# EAGLE design ESP32 (EAGLE 9.5.2)

## Sheet 1 of 6
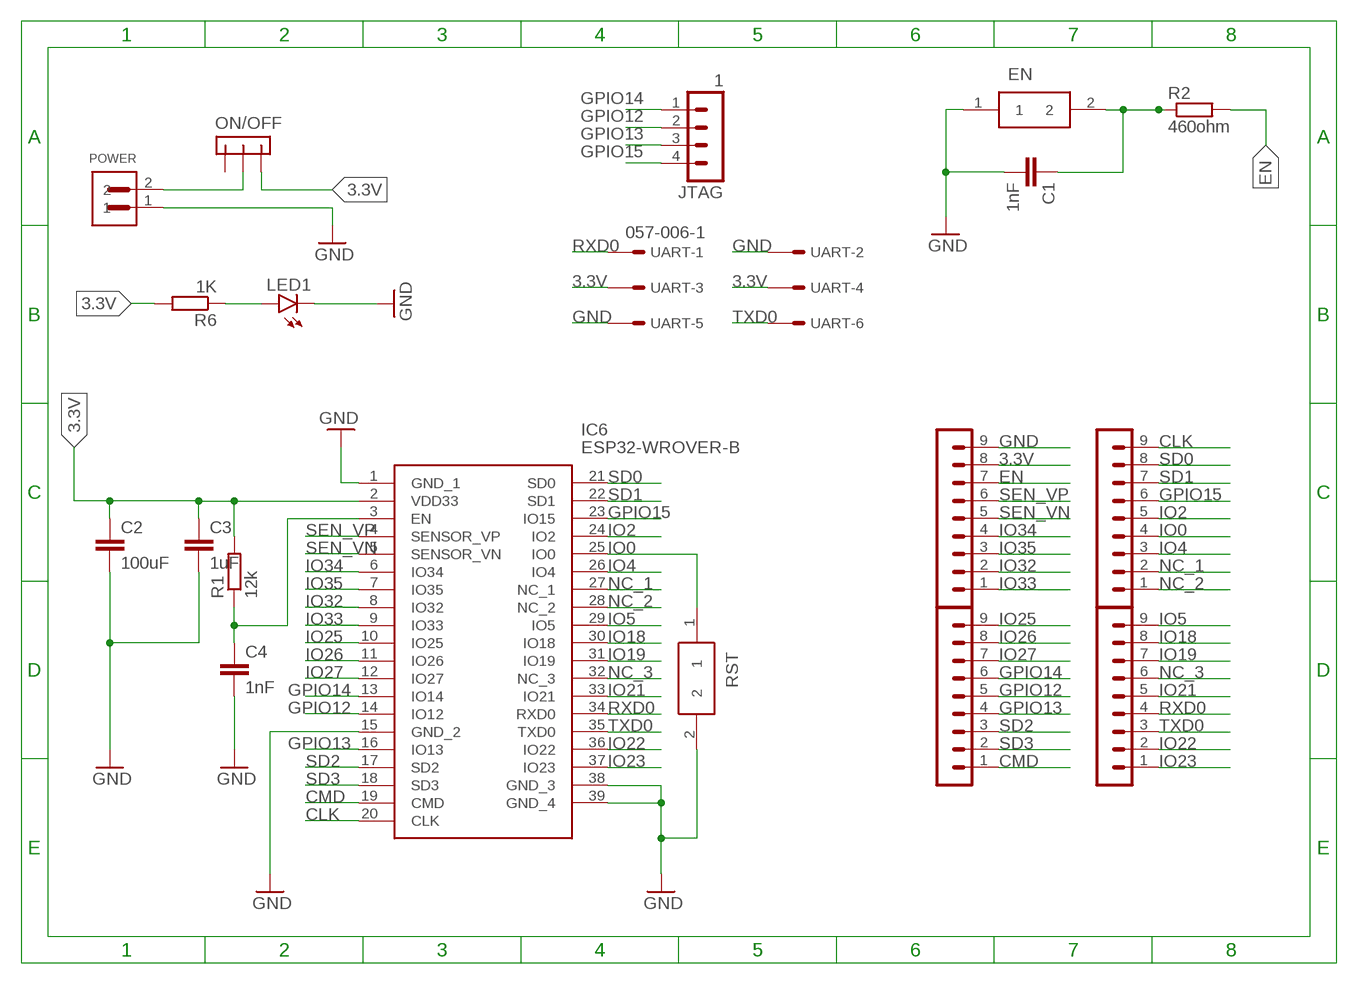
[diagram p0: schematic, sheet 1]

### Parts
C1  1nF  C-EU_805C0805  [C0805]
C2  100uF  C-EU_1206C1206  [C1206]
C3  1uF  C-EU_805C0805  [C0805]
C4  1nF  C-EU_805C0805  [C0805]
EN  FSMSMTR  [FSMSM]
IC6  ESP32-WROVER-B  [ESP32WROVERIB16MB]
JTAG  1  MA04-1  [MA04-1]
LED1  LEDSMT1206  [1206]
ON/OFF  -CON3  [CON3]
POWER  S2B-PH-SM4-TB  [JST_S2B-PH-SM4-TB]
R1  12k  R-EU_805R0805  [R0805]
R2  460ohm  R-EU_805R0805  [R0805]
R6  1K  R-EU_R1206  [R1206]
RST  FSMSMTR  [FSMSM]
SV1  PINHEADER-1X9  [MA09-1]
SV2  PINHEADER-1X9  [MA09-1]
SV5  PINHEADER-1X9  [MA09-1]
SV6  PINHEADER-1X9  [MA09-1]
UART  057-006-1  [057-006-1]

### Nets
3.3V: C2.1 C3.1 IC6.2(VDD33) ON/OFF.P$1 R1.2 R6.2 SV5.8 UART.3 UART.4
CLK: IC6.20(CLK) SV1.9
CMD: IC6.19(CMD) SV6.1
EN [other]: C1.1 C4.1 EN.2 IC6.3(EN) R1.1 R2.1 R2.2 SV5.7
GND: C1.2 C2.2 C3.2 C4.2 EN.1 IC6.1(GND_1) IC6.15(GND_2) IC6.38(GND_3) IC6.39(GND_4) LED1.C POWER.1 RST.2 SV5.9 UART.2 UART.5
GPIO12: IC6.14(IO12) JTAG.2 SV6.5
GPIO13: IC6.16(IO13) JTAG.3 SV6.4
GPIO14: IC6.13(IO14) JTAG.1 SV6.6
GPIO15: IC6.23(IO15) JTAG.4 SV1.6
IO0 [other]: IC6.25(IO0) RST.1 SV1.4
IO2: IC6.24(IO2) SV1.5
IO4: IC6.26(IO4) SV1.3
IO5: IC6.29(IO5) SV2.9
IO18: IC6.30(IO18) SV2.8
IO19: IC6.31(IO19) SV2.7
IO21: IC6.33(IO21) SV2.5
IO22: IC6.36(IO22) SV2.2
IO23: IC6.37(IO23) SV2.1
IO25: IC6.10(IO25) SV6.9
IO26: IC6.11(IO26) SV6.8
IO27: IC6.12(IO27) SV6.7
IO32: IC6.8(IO32) SV5.2
IO33: IC6.9(IO33) SV5.1
IO34: IC6.6(IO34) SV5.4
IO35: IC6.7(IO35) SV5.3
N$1: ON/OFF.P$2 POWER.2
N$14 [other]: LED1.A R6.1
NC_1: IC6.27(NC_1) SV1.2
NC_2: IC6.28(NC_2) SV1.1
NC_3: IC6.32(NC_3) SV2.6
RXD0 [other]: IC6.34(RXD0) SV2.4 UART.1
SD0: IC6.21(SD0) SV1.8
SD1: IC6.22(SD1) SV1.7
SD2: IC6.17(SD2) SV6.3
SD3: IC6.18(SD3) SV6.2
SEN_VN: IC6.5(SENSOR_VN) SV5.5
SEN_VP: IC6.4(SENSOR_VP) SV5.6
TXD0 [other]: IC6.35(TXD0) SV2.3 UART.6
Unconnected: ON/OFF.P$3

## Sheet 2 of 6

## Sheet 3 of 6

## Sheet 4 of 6

## Sheet 5 of 6

## Sheet 6 of 6

## Library data of the parts
C1 C3 C4 = CommonParts:C-EU_805: CAPACITOR, European symbol; SPICEPREFIX: C
C2 = CommonParts:C-EU_1206: CAPACITOR, European symbol; SPICEPREFIX: C
EN RST = FSMSMTR:FSMSMTR: Black Button Tact Switch, SPST 50 mA @ 24 V dc 1.07mm Source: Datasheet <http://www.te.com/commerce/DocumentDelivery/DDEController?Action=showdoc&DocId=Customer Drawing1437566-3C2pdfEnglishENG_CD_1437566-3_C2_1437566_3_1_c.dwg.pdf1437566-4>; ALLIED_NUMBER: 70286948; ALLIED_PRICE-STOCK: https://www.alliedelec.com/te-connectivity-fsmsmtr/70286948/; DESCRIPTION: Black Button Tact Switch, SPST 50 mA @ 24 V dc 1.07mm; HEIGHT: mm; MANUFACTURER_NAME: TE Connectivity; MANUFACTURER_PART_NUMBER: FSMSMTR; MOUSER_PART_NUMBER: 506-FSMSMTR; MOUSER_PRICE-STOCK: https://www.mouser.com/Search/Refine.aspx?Keyword=506-FSMSMTR; RS_PART_NUMBER: 1680547; RS_PRICE-STOCK: http://uk.rs-online.com/web/p/products/1680547
IC6 = ESP32-WROVER-B:ESP32-WROVER-B: WiFi Modules (802.11) SMD Module, ESP32-D0WD, 64Mbits PSRAM, 32Mbits SPI flash, PCB Antenna Source: Datasheet <https://www.espressif.com/sites/default/files/documentation/esp32-wrover-b_datasheet_en.pdf>; DESCRIPTION: WiFi Modules (802.11) SMD Module, ESP32-D0WD, 64Mbits PSRAM, 32Mbits SPI flash, PCB Antenna; HEIGHT: mm; MANUFACTURER_NAME: Espressif Systems; MANUFACTURER_PART_NUMBER: ESP32-WROVER-B; MOUSER_PART_NUMBER: 356-ESP32-WROVER-B; MOUSER_PRICE-STOCK: https://www.mouser.com/Search/Refine.aspx?Keyword=356-ESP32-WROVER-B
JTAG = con-lstb:MA04-1: PIN HEADER; OC_FARNELL: unknown; OC_NEWARK: unknown
LED1 = led:LED: LED OSRAM: - CHIPLED LG R971, LG N971, LY N971, LG Q971, LY Q971, LO R971, LY R971 LH N974, LH R974 LS Q976, LO Q976, LY Q976 LO Q996 - Hyper CHIPLED LW Q18S LB Q993, LB Q99A, LB R99A - SideLED LS A670, LO A670, LY A670, LG A670, LP A670 LB A673, LV A673, LT A673, LW A673 LH A674 LY A675 LS A676, LA A676, LO A676, LY A676, LW A676 LS A679, LY A679, LG A679 - Hyper Micro SIDELED® LS Y876, LA Y876, LO Y876, LY Y876 LT Y87S - SmartLED LW L88C, LW L88S LB L89C, LB L89S, LG L890 LS L89K, LO L89K, LY L89K LS L896, LA L896, LO L896, LY L896 - TOPLED LS T670, LO T670, LY T670, LG T670, LP T670 LSG T670, LSP T670, LSY T670, LOP T670, LYG T670 LG T671, LOG T671, LSG T671 LB T673, LV T673, LT T673, LW T673 LH T674 LS T676, LA T676, LO T676, LY T676, LB T676, LH T676, LSB T676, LW T676 LB T67C, LV T67C, LT T67C, LS T67K, LO T67K, LY T67K, LW E67C LS E67B, LA E67B, LO E67B, LY E67B, LB E67C, LV E67C, LT E67C LW T67C LS T679, LY T679, LG T679 LS T770, LO T770, LY T770, LG T770, LP T770 LB T773, LV T773, LT T773, LW T773 LH T774 LS E675, LA E675, LY E675, LS T675 LS T776, LA T776, LO T776, LY T776, LB T776 LHGB T686 LT T68C, LB T68C - Hyper Mini TOPLED® LB M676 - Mini TOPLED Santana® LG M470 LS M47K, LO M47K, LY M47K Source: http://www.osram.convergy.de LUXEON: - LUMILED® LXK2-PW12-R00, LXK2-PW12-S00, LXK2-PW14-U00, LXK2-PW14-V00 LXK2-PM12-R00, LXK2-PM12-S00, LXK2-PM14-U00 LXK2-PE12-Q00, LXK2-PE12-R00, LXK2-PE12-S00, LXK2-PE14-T00, LXK2-PE14-U00 LXK2-PB12-K00, LXK2-PB12-L00, LXK2-PB12-M00, LXK2-PB14-N00, LXK2-PB14-P00, LXK2-PB14-Q00 LXK2-PR12-L00, LXK2-PR12-M00, LXK2-PR14-Q00, LXK2-PR14-R00 LXK2-PD12-Q00, LXK2-PD12-R00, LXK2-PD12-S00 LXK2-PH12-R00, LXK2-PH12-S00 LXK2-PL12-P00, LXK2-PL12-Q00, LXK2-PL12-R00 Source: www.luxeon.com KINGBRIGHT: KA-3528ASYC Source: www.kingbright.com
ON/OFF = tango:-CON3
POWER = S2B-PH-SM4-TB:S2B-PH-SM4-TB: CONN HEADER PH SIDE 2POS 2MM SMD; AVAILABILITY: Unavailable; DESCRIPTION: Socket; wire-board; male; PIN: 2; 2mm; SMT; PH; 100V; 2A; -25÷85°C; MF: JST Sales; MP: S2B-PH-SM4-TB; PACKAGE: None; PRICE: None
R1 R2 = CommonParts:R-EU_805: RESISTOR, European symbol
R6 = rcl:R-EU_: RESISTOR, European symbol; SPICEPREFIX: R
SV1 SV2 SV5 SV6 = CommonParts:PINHEADER-1X9: PIN HEADER; OC_FARNELL: unknown; OC_NEWARK: unknown
UART = con-panduit:057-006-: CONNECTOR 6-pin series 057 contact pc board low profile headers; OC_FARNELL: unknown; OC_NEWARK: unknown

## Net classes
1 other: width 0.2 mm, drill 0.2 mm, clearance 0.1 mm

## Board
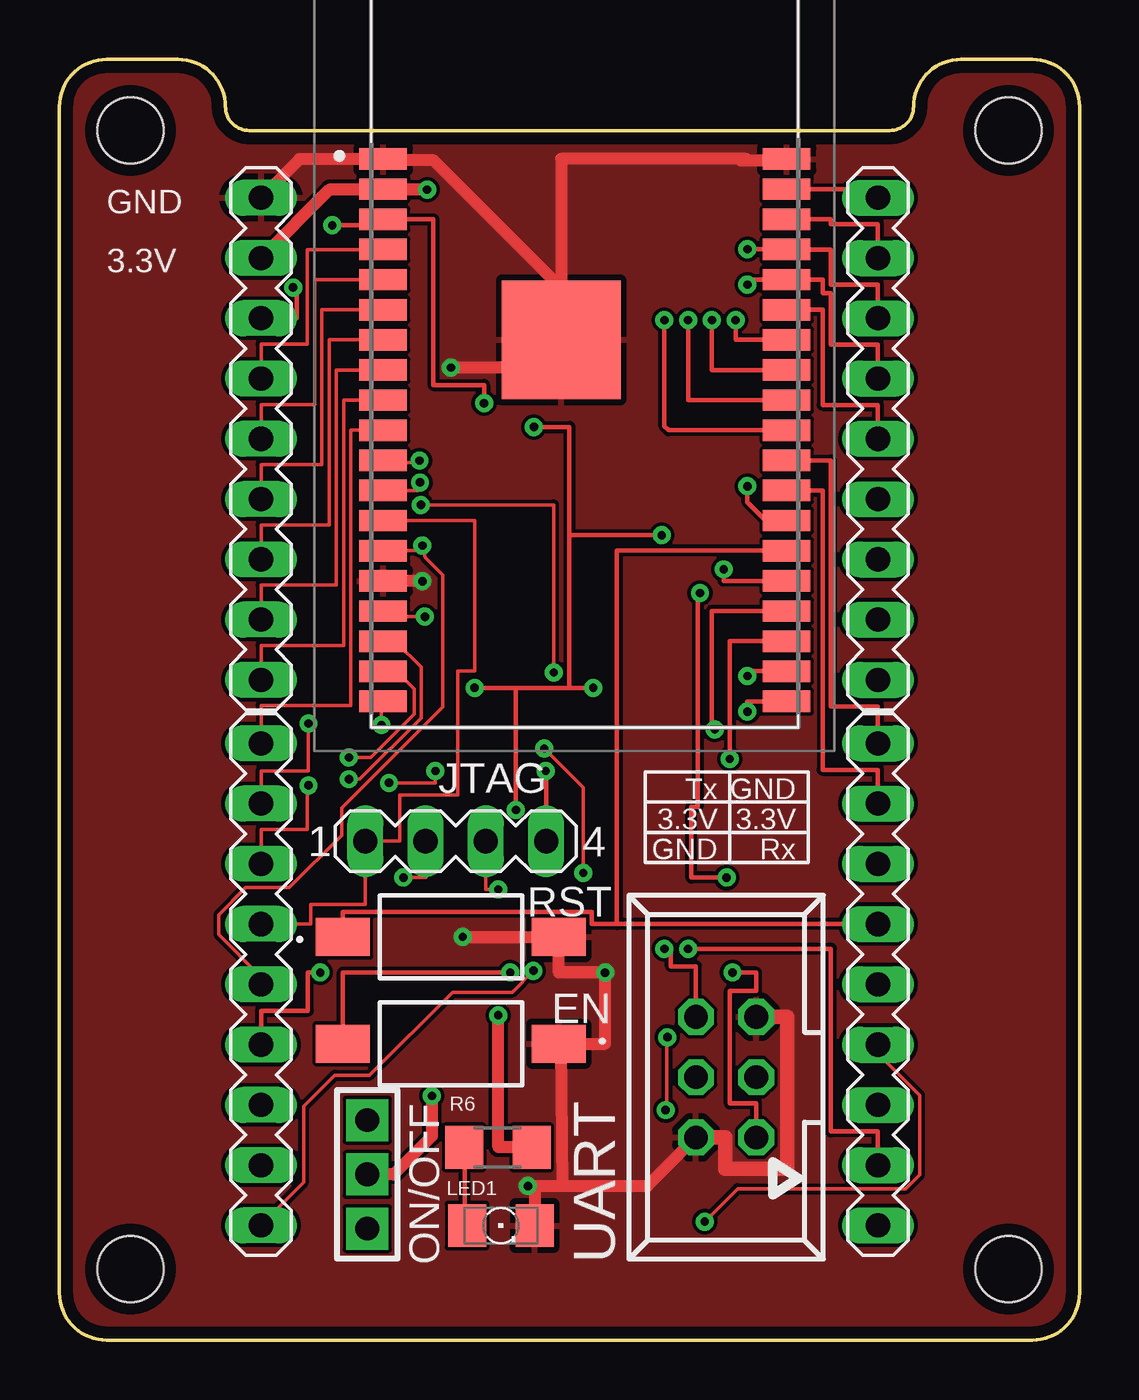
[diagram p1: board, top side]
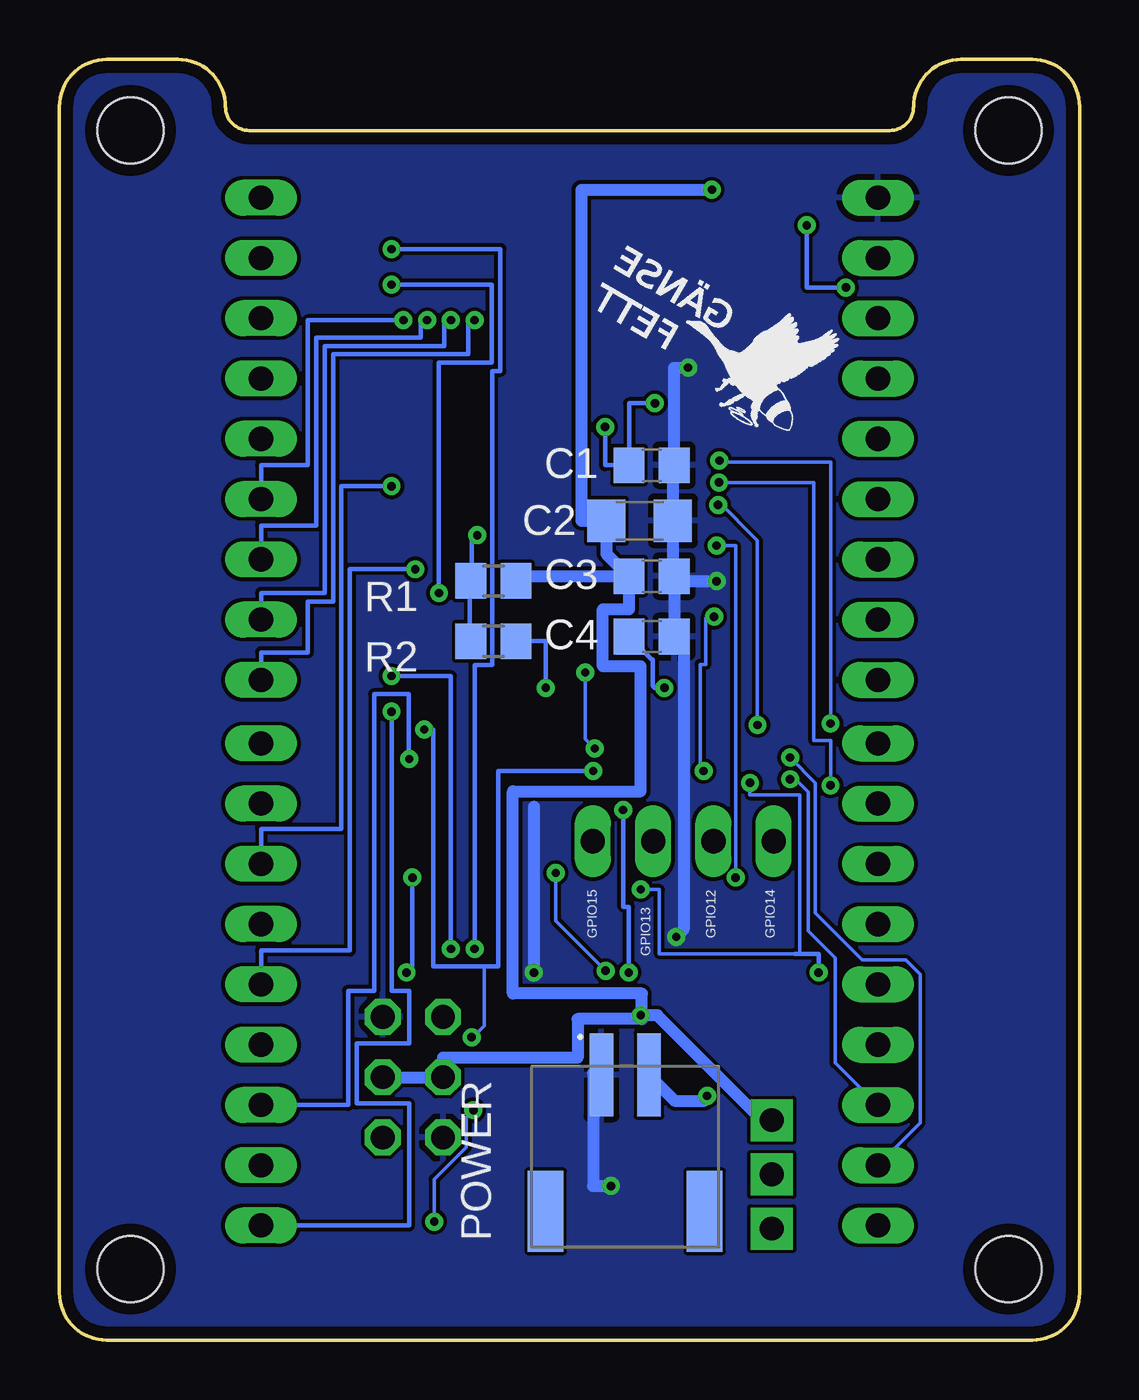
[diagram p2: board, bottom side, seen from below]

Size 43 x 54 mm. Coordinates in mm from the lower left corner, seen from the top.
Outline: 0,52 0,2 arc90 2,0 41,0 arc90 43,2 43,52 arc90 41,54 38,54 arc90 36,52 arc-90 35,51 8,51 arc-90 7,52 arc90 5,54 2,54 arc90 0,52
Copper layers (1*16): Top 0.035mm / dielectric 1.5mm / Bottom 0.035mm
Design rules "default *": minimum track width 6mil, minimum drill 0.35mm, track to track 6mil, track to pad 6mil, pad to pad 6mil, via to via 6mil, smd to smd 6mil, copper to edge 20mil, drill to drill 6mil, minimum pad ring 10mil, minimum via ring 8mil, stop-mask expansion 4mil, vias tented up to drill 0mil, thermal gap 10mil
Holes 2.8 mm at 3,51 40,51 40,3 3,3

### Footprints (pad centres in the part's own frame; a part is rotated, then mirrored left to right if it is on the bottom)
C0805 = smd 1.3 x 1.5: 1 -0.95,0; 2 0.95,0
C1206 = smd 1.6 x 1.8: 1 -1.4,0; 2 1.4,0
FSMSM = smd 2.27 x 1.6: 1 -4.55,0; 2 4.55,0
ESP32WROVERIB16MB = smd 2 x 0.9: 1 -7.85,8.26; 2 -7.85,6.99; 3 -7.85,5.72; 4 -7.85,4.45; 5 -7.85,3.18; 6 -7.85,1.91; 7 -7.85,0.64; 8 -7.85,-0.63; 9 -7.85,-1.9; 10 -7.85,-3.17; 11 -7.85,-4.44; 12 -7.85,-5.71; 13 -7.85,-6.98; 14 -7.85,-8.25; 15 -7.85,-9.52; 16 -7.85,-10.79; 17 -7.85,-12.06; 18 -7.85,-13.33; 19 -7.85,-14.6; 20 9.15,-14.6; 21 9.15,-13.33; 22 9.15,-12.06; 23 9.15,-10.79; 24 9.15,-9.52; 25 9.15,-8.25; 26 9.15,-6.98; 27 9.15,-5.71; 28 9.15,-4.44; 29 9.15,-3.17; 30 9.15,-1.9; 31 9.15,-0.63; 32 9.15,0.64; 33 9.15,1.91; 34 9.15,3.18; 35 9.15,4.45; 36 9.15,5.72; 37 9.15,6.99; 38 9.15,8.26 | smd 5 x 5: 39 -0.35,0.64
MA04-1 = drill 1.016 long: 1 -3.81,0; 2 -1.27,0; 3 1.27,0; 4 3.81,0
1206 = smd 1.6 x 1.803: A -1.422,0; C 1.422,0
CON3 = drill 1 pad 1.778 square: P$1 -2.794,0.254; P$2 -0.508,0.254; P$3 1.778,0.254
JST_S2B-PH-SM4-TB = smd 1 x 3.5: 1 1,0; 2 -1,0 | smd 1.5 x 3.4: P1 3.35,5.75; P2 -3.35,5.75
R0805 = smd 1.3 x 1.5: 1 -0.95,0; 2 0.95,0
R1206 = smd 1.6 x 1.803: 1 -1.422,0; 2 1.422,0
MA09-1 = drill 1.016 long: 1 -10.16,0; 2 -7.62,0; 3 -5.08,0; 4 -2.54,0; 5 0,0; 6 2.54,0; 7 5.08,0; 8 7.62,0; 9 10.16,0
057-006-1 = drill 1 octagon: 1 -2.54,-1.27; 2 -2.54,1.27; 3 0,-1.27; 4 0,1.27; 5 2.54,-1.27; 6 2.54,1.27

### Placement (x,y rotation side)
C1  18.04,36.89 0 bottom
C2  18.54,34.55 0 bottom
C3  18.04,32.21 0 bottom
C4  18.04,29.67 0 bottom
EN  16.5,12.5 180 top
IC6  21.5,41.53 0 top
JTAG  16.7,21.04 0 top
LED1  18.61,4.83 0 top
ON/OFF  12.72,6.48 270 top
POWER  19.15,11.19 180 bottom
R1  24.7,32.01 0 bottom
R2  24.7,29.47 180 bottom
R6  18.48,8.13 0 top
RST  16.5,17 0 top
SV1  34.5,15 270 top
SV2  34.5,38 270 top
SV5  8.5,38 90 top
SV6  8.5,15 90 top
UART  28.1,11.09 90 top

### Tracks (layer width: path | path; a pad name or v marks a point on that pad's centre or on a via)
3.3V  (via drill 0.35)
  Top 0.508: SV5.8 11.4,48.52 IC6.2 13.65,48.5 v15.5,48.5 | R6.2 18.5,8.13 v18.5,13.7
  Bottom 0.508: 18.45,13.75 18.45,13.54 21.16,13.54 21.16,11.91 26.83,11.91 UART.4 UART.3 | 18.45,13.75 v18.5,13.7 17.8,13.7 13.37,9.27 ON/OFF.P$1 | 18.45,13.75 18.45,14.61 23.89,14.61 23.89,23.14 18.5,23.14 18.5,28.41 20.09,28.41 20.09,30.82 18.99,30.82 C3.1 | C3.1 23.55,32.21 R1.2 | v15.5,48.5 21,48.5 21,34.55 C2.1 19.94,33.16 C3.1
CLK  (via drill 0.35)
  Top 0.2: v29,26.5 29,26.93 IC6.20
  Bottom 0.2: v29,26.5 29,14.73 28.26,14.73 28.26,12.52 30.48,12.52 30.48,9.98 28.26,9.98 28.26,4.84 SV1.9
CMD  (via drill 0.35)
  Top 0.152: v13.58,25.94 13.58,26.93 IC6.19 | v20.84,28.15 20.84,35.22 v15.24,35.22 | v20.44,24.95 22.08,23.3 v22.08,19.7 | v19.98,15.57 19.08,14.67 16.57,14.67 13.07,11.17 11.61,11.17 10.3,9.86 10.3,6.66 8.55,4.91 SV6.1
  Bottom 0.152: v13.58,25.94 13.58,33.71 15.24,35.37 v15.24,35.22 | v20.44,24.95 20.84,25.35 v20.84,28.15 | v22.08,19.7 22.08,17.67 v19.98,15.57
EN  (via drill 0.35)
  Top 0.2: v17.9,39.5 17.9,40.27 15.77,40.27 15.77,47.25 IC6.3 13.65,47 v11.5,47 | v20,38.5 21.5,38.5 21.5,33.94 | 21.5,27.5 19.24,27.5 | 19.24,27.5 v17.5,27.5 | 21.5,33.94 21.5,27.5 | v22.5,27.5 21.5,27.5 | SV5.7 10,43.08 10,44.5 9.85,44.5 v9.85,44.38 | EN.2 11.95,15.5 v19,15.5 | v19.24,22.36 19.24,27.5 | 21.5,33.94 v25.39,33.94
  Bottom 0.2: v17.9,39.5 18.99,39.5 C1.1 20,36.89 v20,38.5 | v17.5,27.5 17.9,27.5 17.99,27.59 17.99,28.7 18.02,28.7 C4.1 | R2.1 22.5,29.47 v22.5,27.5 | v9.85,44.38 11.5,44.38 v11.5,47 | v19,15.5 19,18.27 19.23,18.27 19.23,22.5 19.4,22.5 19.4,22.36 v19.24,22.36 | R2.2 25.69,29.52 25.69,31.96 R1.1 25.62,32.03 25.62,33.71 v25.39,33.94
GND  (via drill 0.35)
  Top 0.152: IC6.38 30.65,49.74 | 13.88,49.74 13.88,49.79 IC6.1
  Top 0.508: LED1.C 20.03,6.22 v19.75,6.5 21.23,6.5 | 21.23,6.5 24.78,6.5 UART.2 | 28.72,49.74 29,49.74 | 29,49.74 30.65,49.74 | 21.15,44.35 15.76,49.74 13.88,49.74 13.65,49.74 | IC6.1 10.13,49.79 SV5.9 | 21.15,41 v16.5,41 | v15.3,32 IC6.15 | 21.23,6.5 21.15,12.4 EN.1 23,12.5 v23,15.5 21.05,15.5 RST.2 v17,17 | 29,49.74 28.94,49.8 21.15,49.8 IC6.39
  Top 0.61: UART.2 28.05,8.55 28.05,7.23 30.68,7.23 30.68,13.63 UART.5
  Bottom 0.508: POWER.1 20.22,11.25 20.5,11.25 20.5,6.5 v19.75,6.5 | C3.2 C4.2 16.69,29.27 16.69,17.31 v17,17 | C3.2 17.09,32 v15.3,32 | v16.5,41 17.09,41 C1.2 17.14,36.84 C2.2 17.14,32.26 C3.2 | 23,22.48 v23,15.5
  pour Top: 0,54 43,54 43,0 0,0
  pour Bottom: 0,54 43,54 43,0 0,0
GPIO12  (via drill 0.35)
  Top 0.152: JTAG.2 15.43,19.5 v14.5,19.5 | IC6.14 15.3,33.28 v15.3,33.5 15.43,33 16.17,32.26 16.17,26.7 11.9,22.43 11.9,21.29 9.69,19.08 7.86,19.08 6.72,17.94 6.72,17.1 8.47,15.34 8.47,15.04 SV6.5
  Bottom 0.152: v14.5,19.5 14.5,33.5 v15.3,33.5
GPIO13  (via drill 0.35)
  Top 0.152: IC6.16 13.65,30.5 v15.41,30.5 | v15.85,24 15.85,23.5 v13.89,23.5 | v18.5,19 17.97,19 JTAG.3
  Top 0.2: SV6.4 8.5,13.88 10.48,13.88 10.48,15.5 v11,15.5
  Bottom 0.152: v15.85,24 16,24 16,28.49 15.76,28.49 15.76,30.45 15.7,30.5 v15.41,30.5 | v18.5,19 17.71,19 17.71,16.29 12,16.29 11.8,16.29 11.8,22.99 13.89,22.99 v13.89,23.5
  Bottom 0.2: v11,15.5 11,16.29 12,16.29
GPIO14
  Top 0.152: SV6.6 10.59,17.54 10.59,18.38 12.89,18.38 JTAG.1 14.34,21.04 14.34,22.99 16.79,22.99 16.79,28.21 17.5,28.21 17.5,34.55 IC6.13
GPIO15  (via drill 0.35)
  Top 0.152: v25.62,12.78 25.6,12.75 25.6,9.75 v25.55,9.7 | v27.2,5 28.59,6.39 35.67,6.39 36.25,6.97 36.25,10.33 34.5,12.08 SV1.6
  Top 0.2: IC6.23 27.5,30.74 27.5,25.75 v27.62,25.75 | v20.5,24 20.51,24 JTAG.4
  Bottom 0.152: 25.1,15.77 25.1,13.25 25.6,12.75 v25.62,12.78 | v25.55,9.7 25.84,9.41 25.84,8.14 27.2,6.79 v27.2,5
  Bottom 0.2: v27.62,25.75 27.23,25.75 27.23,15.77 25.1,15.77 24.5,15.77 24.5,24 v20.5,24
IO0
  Top 0.2: SV1.4 23.5,17.54 | 23.5,17.54 22.44,17.54 22.44,18.05 11.95,18.05 RST.1 | IC6.25 23.5,33.28 23.5,17.54
IO2  (via drill 0.35)
  Top 0.2: IC6.24 28,32.01 v28,32.5
  Bottom 0.2: v28,32.5 30.76,32.5 30.76,16.42 34.5,16.42 SV1.5
IO4  (via drill 0.35)
  Top 0.2: IC6.26 29.75,34.55 29.75,34.59 29,35.34 v29,36
  Bottom 0.2: v29,36 31.11,36 31.11,21.55 34.5,21.55 SV1.3
IO5  (via drill 0.35)
  Top 0.2: IC6.29 25.68,38.36 25.5,38.54 v25.5,43
  Bottom 0.2: v25.5,43 25.77,43 25.77,41.56 31.46,41.56 31.46,31.15 32.52,31.15 32.52,29 34.5,29 SV2.9
IO18  (via drill 0.35)
  Top 0.2: IC6.30 26.5,39.63 v26.5,43
  Bottom 0.2: v26.5,43 26.77,43 26.77,41.91 31.82,41.91 31.82,31.5 34.5,31.5 SV2.8
IO19  (via drill 0.35)
  Top 0.2: IC6.31 27.5,40.9 v27.5,43
  Bottom 0.2: v27.5,43 27.77,43 27.77,42.27 32.17,42.27 32.17,34.34 34.5,34.34 SV2.7
IO21
  Top 0.2: IC6.33 32.17,43.44 32.17,39.42 34.5,39.42 SV2.5
IO22
  Top 0.2: IC6.36 32.52,47.25 32.52,47.04 34.5,47.04 SV2.2
IO23
  Top 0.2: IC6.37 34.5,48.52 SV2.1
IO25
  Top 0.152: IC6.10 12.29,38.36 12.29,26.75 8.5,26.75 SV6.9
IO26  (via drill 0.35)
  Top 0.152: SV6.8 8.5,24 10.5,24 v10.5,26 | v15.18,37.08 15.27,36.99 13.65,36.99 IC6.11
  Bottom 0.152: v10.5,26 10.5,37.01 15.11,37.01 v15.18,37.08
IO27  (via drill 0.35)
  Top 0.152: SV6.7 8.5,21.53 10.46,21.53 10.46,23.5 10.5,23.5 v10.5,23.39 | v15.2,36.16 15.1,36.06 15.1,35.82 IC6.12
  Bottom 0.152: v10.5,23.39 10.5,25.29 11.21,25.29 11.21,36.16 v15.2,36.16
IO32
  Top 0.152: IC6.8 11.68,40.9 11.68,31.83 8.5,31.83 SV5.2
IO33
  Top 0.152: IC6.9 11.98,39.63 11.98,29.29 8.5,29.29 SV5.1
IO34
  Top 0.152: IC6.6 11.07,43.44 11.07,36.91 8.5,36.91 SV5.4
IO35
  Top 0.152: IC6.7 11.37,42.17 11.37,34.37 8.5,34.37 SV5.3
N$1  (via drill 0.35)
  Top 0.508: v15.7,10.3 15.7,8.6 14.09,6.99 ON/OFF.P$2
  Bottom 0.508: POWER.2 17.07,10.1 15.8,10.1 15.7,10.2 v15.7,10.3
N$14
  Top 0.2: R6.1 17.08,8.11 17.08,4.98 17.16,4.91 LED1.A
NC_1
  Top 0.2: IC6.27 32.17,35.82 32.17,24.04 34.5,24.04 SV1.2
NC_2
  Top 0.2: IC6.28 32.52,37.09 32.52,26.72 34.5,26.72 SV1.1
NC_3  (via drill 0.35)
  Top 0.2: IC6.32 28.5,42.17 v28.5,43
  Bottom 0.2: v28.5,43 32.52,43 32.52,36.88 34.5,36.88 SV2.6
RXD0  (via drill 0.35)
  Top 0.2: SV2.4 34.5,41.96 32.52,41.96 32.52,44.15 32.17,44.15 32.17,44.71 IC6.34 29,44.71 v29,44.5 | v28.37,15.5 29.37,15.5 29.37,14.73 28.26,14.73 28.26,9.98 29.37,9.98 UART.1 | v27,31.5 26.9,31.4 26.9,22.48 26.64,22.48 26.64,19.5 v28.12,19.5
  Bottom 0.2: v28.37,15.5 28.12,15.75 v28.12,19.5 28.25,19.5 | v27,31.5 27,41.21 24.77,41.21 24.77,44.5 v29,44.5
SD0  (via drill 0.35)
  Top 0.2: SV1.8 34.5,8.8 32.52,8.8 32.52,16.5 v26.5,16.5 | v29,28 29,28.2 IC6.21
  Bottom 0.2: v26.5,16.5 26.5,28 v29,28
SD1  (via drill 0.35)
  Top 0.2: IC6.22 28.25,29.47 v28.25,24.5
  Bottom 0.2: SV1.7 30.83,9.92 30.83,14.73 29.73,14.73 29.73,27.23 28.27,27.23 28.27,24.5 v28.25,24.5
SD2  (via drill 0.35)
  Top 0.152: v12.21,23.65 12.66,23.65 15.25,26.24 15.25,28.38 14.19,29.44 13.65,29.44 IC6.17
  Bottom 0.152: v12.21,23.65 11.98,23.65 11.44,23.12 11.44,17.25 10.3,16.11 10.3,11.69 8.55,9.93 SV6.3
SD3  (via drill 0.35)
  Top 0.152: v12.21,24.57 13.12,24.57 14.95,26.39 14.95,27.46 14.26,28.15 13.65,28.15 IC6.18
  Bottom 0.152: v12.21,24.57 11.14,23.5 11.14,18.01 9.16,16.03 7.33,16.03 6.72,15.42 6.72,9.17 8.47,7.42 SV6.2
SEN_VN
  Top 0.152: IC6.5 10.76,44.71 10.76,39.45 8.5,39.45 SV5.5
SEN_VP
  Top 0.152: IC6.4 10.46,45.98 10.46,41.99 8.5,41.99 SV5.6
TXD0  (via drill 0.35)
  Top 0.2: UART.6 26.83,15.77 25.77,15.77 25.77,16.5 v25.5,16.5 | v29,46 30.65,46 IC6.35 32.52,45.98 32.52,44.5 34.5,44.5 SV2.3
  Bottom 0.2: v29,46 24.41,46 24.41,40.86 24.75,40.86 24.75,28.46 25.5,28.46 v25.5,16.5

### Text on the board
tNames: GND | 3.3V | Tx | GND | 3.3V | 3.3V | GND | Rx | ON/OFF
bNames: GPIO14 | GPIO12 | GPIO15 | GPIO13